# Altium schematic sheet PWRInput.SchDoc
size A4
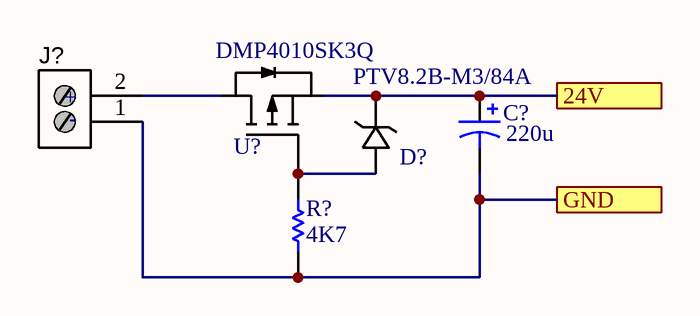
[diagram p0: PWRInput.SchDoc]

## Parts
C?  value 220u  [CAP_ELEC_SIZE_G]  (hidden comment: Cap Pol1)
D?  PTV8.2B-M3/84A  [DO-220AA]
J?  Stackable ScrewTerm  [2P_PCB_TERM]  (value not drawn)
R?  value 4K7  [RESC1608N_ZERO]  (hidden comment: Res1)
U?  DMP4010SK3Q  [TO-252]

## Ports
24V, GND

## Nets
24V: C?.1 D?.K U?.3(S) ; port 24V
GND: C?.2 J?.1 R?.1 ; port GND
NetD?_A: D?.A R?.2 U?.1(G)
NetJ?_2: J?.2 U?.4(D)

## Notes on the sheet
- (in symbol 2P_ScrewTerm_90S_3.81MM) +; -

## Library data of the parts
C? = Cap Pol1: Polarized Capacitor (Radial); Published: 8-Jun-2000; LatestRevisionDate: 17-Jul-2002; LatestRevisionNote: Re-released for DXP Platform.; PackageReference: RB7.6-15; Publisher: Altium Limited; PackageDescription: Polarized Capacitor (Radial); 2 Leads
D? = PTV8.2B-M3/84A: zener diode, Surface Mount Power Voltage-Regulating Diodes; Manufacturer: Vishay; Vz: 8.2V-9.3V; Pd: 1.5W; datasheet: http://www.mouser.com/ds/2/427/ptvxxb-100167.pdf
J? = 2P_ScrewTerm_90S_3.81MM: Terminal Block Screw Type THT 2-Position 3.81mm pitch; Manufacturer 1: Tyco Electronics; Manufacturer Part Number 1: 1776113-2; Value: 2 position; Pitch: 0.150" (3.81mm); Positions Per Level: 2; SCDType: undef; Package / Case: Side Entry; 3.81mm pitch; Category: Connectors Interconnects; Color: Black; Supplier 1: Digi-Key; Supplier Part Number 1: A97976-ND
R? = Res1: Resistor; Published: 8-Jun-2000; LatestRevisionDate: 17-Jul-2002; LatestRevisionNote: Re-released for DXP Platform.; PackageReference: AXIAL-0.3; Publisher: Altium Limited; PackageDescription: Axial Device, Thru-Hole; 2 Leads; 0.3 in Pin Spacing